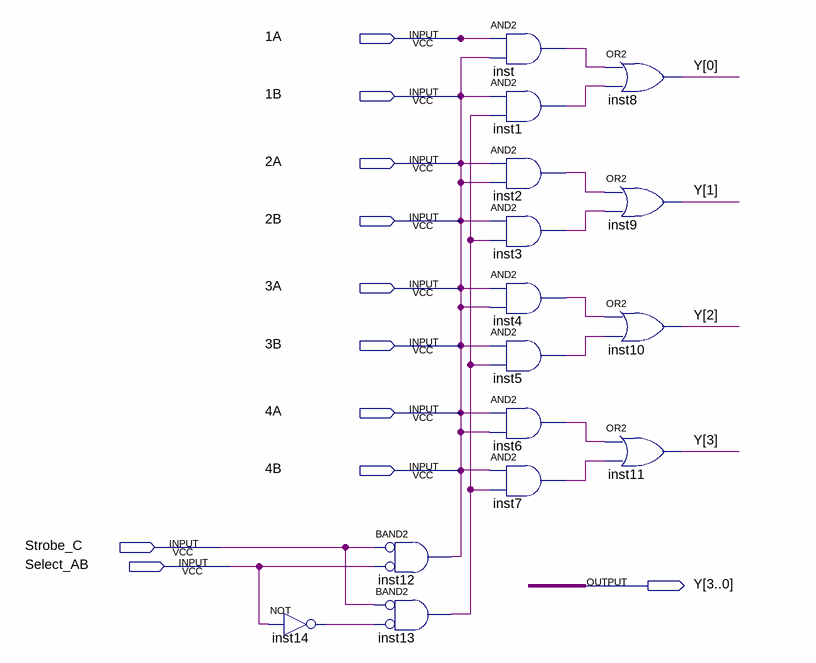
[diagram p0: schematic sheet]
// Quartus schematic selecter_74LS157.bdf as structural Verilog: 15 symbols, 11 pins
module selecter_74LS157 (
  input  \1A ,
  input  \1B ,
  input  \2A ,
  input  \2B ,
  input  \3A ,
  input  \3B ,
  input  \4A ,
  input  \4B ,
  input  Strobe_C,
  input  Select_AB,
  output [3:0] Y
);

  wire inst1_out, inst2_out, inst3_out, inst4_out, inst5_out, inst6_out, inst7_out, inst13_out, inst14_out,
       inst_out;

  not inst14 (inst14_out, Select_AB);
  and inst12 (\1B , ~Strobe_C, ~Select_AB);  // BAND2
  and inst13 (inst13_out, ~Strobe_C, ~inst14_out);  // BAND2
  and inst (inst_out, \1A , \1B );
  and inst1 (inst1_out, \1B , inst13_out);
  and inst2 (inst2_out, \1B , \1B );
  and inst3 (inst3_out, \1B , inst13_out);
  and inst4 (inst4_out, \1B , \1B );
  and inst5 (inst5_out, \1B , inst13_out);
  and inst6 (inst6_out, \1B , \1B );
  and inst7 (inst7_out, \1B , inst13_out);
  or inst8 (Y[0], inst_out, inst1_out);
  or inst9 (Y[1], inst2_out, inst3_out);
  or inst10 (Y[2], inst4_out, inst5_out);
  or inst11 (Y[3], inst6_out, inst7_out);

  assign \2A  = \1B ;
  assign \2B  = \1B ;
  assign \3A  = \1B ;
  assign \3B  = \1B ;
  assign \4A  = \1B ;
  assign \4B  = \1B ;
endmodule
